# Altium schematic sheet LED_ZuTu-7.1.SchDoc
size A4
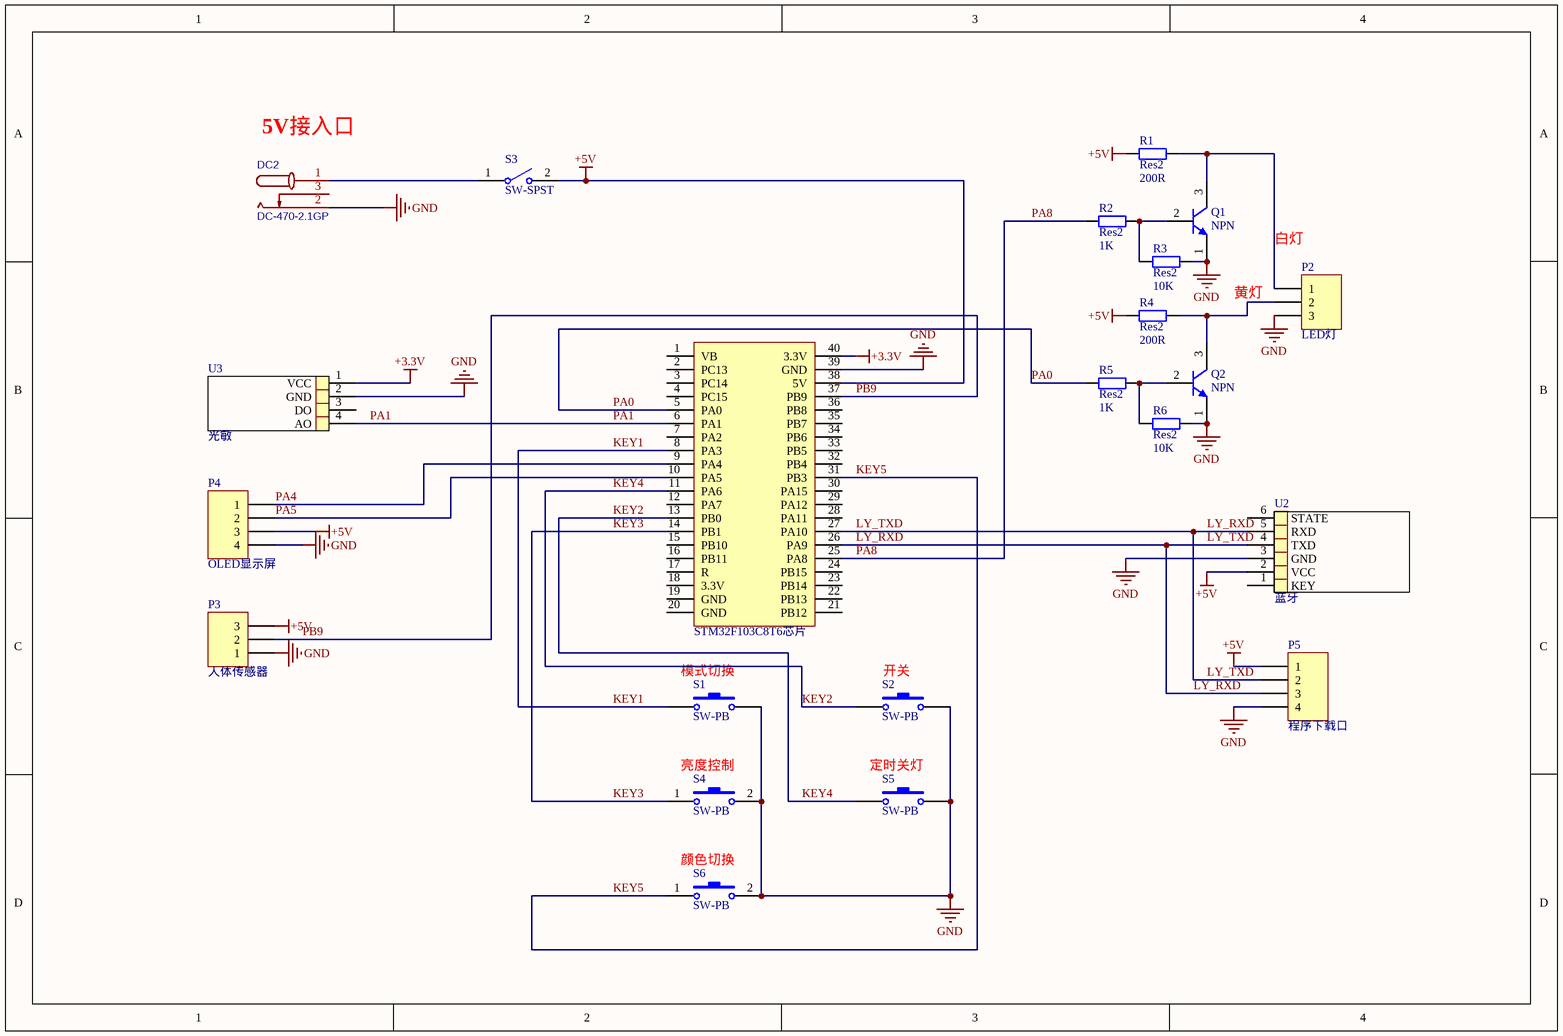
[diagram p0: LED_ZuTu-7.1.SchDoc]

## Parts
DC2  DC-470-2.1GP  [DC-470-2.1GP - duplicate]
P2  LED灯  [HDR1X3]
P3  人体传感器  [HDR1X3]
P4  OLED显示屏  [HDR1X4]
P5  程序下载口  [HDR1X4]
Q1  NPN  [SOT-23R]
Q2  NPN  [SOT-23R]
R1  Res2  value 200R  [0805]
R2  Res2  value 1K  [0805]
R3  Res2  value 10K  [0805]
R4  Res2  value 200R  [0805]
R5  Res2  value 1K  [0805]
R6  Res2  value 10K  [0805]
S1  SW-PB  [KEY_M]
S2  SW-PB  [KEY_M]
S3  SW-SPST  [BTN8.5*8.5]
S4  SW-PB  [KEY_M]
S5  SW-PB  [KEY_M]
S6  SW-PB  [KEY_M]
STM32F103C8T6芯片  stm32f103c8t6_Board  [stm32-port]  (value not drawn)
U2  蓝牙  [HDR1X6]
U3  光敏  [HDR1X4]

## Nets
+3.3V: STM32F103C8T6芯片.40(3.3V) U3.1(VCC)
+5V: P3.3 P4.3 P5.1 R1.1 R4.1 S3.2(NO) STM32F103C8T6芯片.38(5V) U2.2(VCC)
GND: DC2.2 P2.3 P3.1 P4.4 P5.4 Q1.1(E) Q2.1(E) R3.2 R6.2 S1.2 S2.2 S4.2 S5.2 S6.2 STM32F103C8T6芯片.39(GND) U2.3(GND) U3.2(GND)
KEY1: S1.1 STM32F103C8T6芯片.8(PA3)
KEY2: S2.1 S5.1 STM32F103C8T6芯片.11(PA6) STM32F103C8T6芯片.13(PB0)  [also labelled KEY4]
KEY3: S4.1 STM32F103C8T6芯片.14(PB1)
KEY5: S6.1 STM32F103C8T6芯片.31(PB3)
LY_RXD: P5.2 P5.3 STM32F103C8T6芯片.26(PA9) STM32F103C8T6芯片.27(PA10) U2.4(TXD) U2.5(RXD)  [also labelled LY_TXD]
PA0: R5.1 STM32F103C8T6芯片.5(PA0)
PA1: STM32F103C8T6芯片.6(PA1) U3.4(AO)
PA4: P4.1 STM32F103C8T6芯片.9(PA4)
PA5: P4.2 STM32F103C8T6芯片.10(PA5)
PA8: R2.1 STM32F103C8T6芯片.25(PA8)
PB9: P3.2 STM32F103C8T6芯片.37(PB9)
NetDC2_1: DC2.1 S3.1(COMMON)
NetP2_1: P2.1 Q1.3(C) R1.2
NetP2_2: P2.2 Q2.3(C) R4.2
NetQ1_2: Q1.2(B) R2.2 R3.1
NetQ2_2: Q2.2(B) R5.2 R6.1

Not connected (* = marked no-connect by the designer): DC2 3; STM32F103C8T6芯片 1(VB) 2(PC13) 3(PC14) 4(PC15) 7(PA2) 12(PA7) 15(PB10) 16(PB11) 17(R) 18(3.3V) 19(GND) 20(GND) 21(PB12) 22(PB13) 23(PB14) 24(PB15) 28(PA11) 29(PA12) 30(PA15) 32(PB4) 33(PB5) 34(PB6) 35(PB7) 36(PB8); U2 1(KEY) 6(STATE); U3 3(DO)

## Notes on the sheet
- (near DC2) 5V接入口
- 白灯
- 黄灯
- (near S1) 模式切换
- (near S2) 开关
- (near S4) 亮度控制
- (near S5) 定时关灯
- (near S6) 颜色切换

## Library data of the parts
DC2 = DC-470-2.1GP: BOM_Manufacturer: GANGYUAN; Contributor: LCSC; BOM_Supplier: LCSC; BOM_Supplier Part: C194407; BOM_Manufacturer Part: DC-470-2.1GP; spicePre: D
P2 P3 = Header 3: Header, 3-Pin; LatestRevisionDate: 17-Jul-2002; LatestRevisionNote: Re-released for DXP Platform.; Publisher: Altium Limited
P4 P5 = Header 4: Header, 4-Pin; LatestRevisionDate: 17-Jul-2002; LatestRevisionNote: Re-released for DXP Platform.; Publisher: Altium Limited
Q1 Q2 = NPN: NPN Bipolar Transistor; Published: 8-Jun-2000; LatestRevisionDate: 17-Jul-2002; LatestRevisionNote: Re-released for DXP Platform.; PackageReference: TO-226-AA; Publisher: Altium Limited; PackageDescription: TO, Flat Index; 3 In-Line, Axial Leads; Body Dia. 4.8mm; Leads 0.55 x 0.51 mm (max); Code_JEDEC: TO-226-AA
R1-R6 = Res2: 贴片电阻8050; Published: 8-Jun-2000; LatestRevisionDate: 17-Jul-2002; LatestRevisionNote: Re-released for DXP Platform.; PackageReference: AXIAL-0.4; Publisher: Altium Limited; PackageDescription: Axial Device, Thru-Hole; 2 Leads; 0.4 in Pin Spacing
S1 S2 S4-S6 = SW-PB: Switch; Published: 24-Mar-1999; LatestRevisionDate: 17-Jul-2002; LatestRevisionNote: Re-released for DXP Platform.; PackageReference: SPST-2; Publisher: Altium Limited; PackageDescription: Switch; 2 Leads
S3 = SW-SPST: Single-Pole, Single-Throw Switch; Published: 24-Mar-1999; LatestRevisionDate: 17-Jul-2002; LatestRevisionNote: Re-released for DXP Platform.; PackageReference: SPST-2; Publisher: Altium Limited; PackageDescription: Switch; 2 Leads
STM32F103C8T6芯片 = stm32f103c8t6_Board: MCU
U2 = LY
U3 = GM